# EAGLE design ESP-8266 Datalogger (EAGLE 7.5.0)
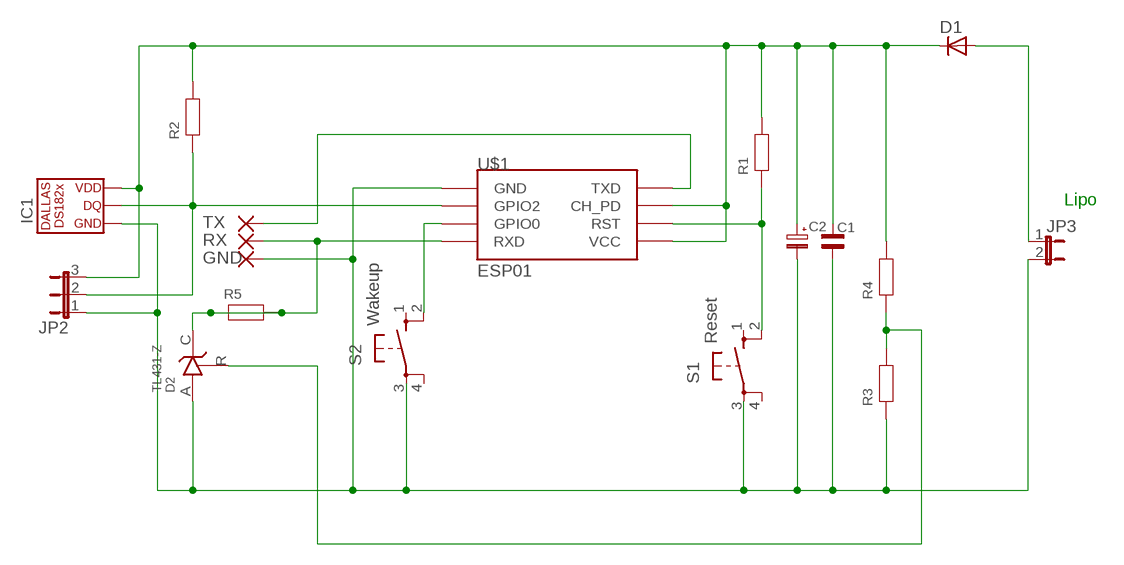
[diagram p0: schematic, sheet 1]

## Parts
C1  C-C1206  [C1206]
C2  ELKO-SMC_B  [SMC_B]
D1  BYS10  [SOD106A]
D2  TL431-Z  [TO92-Z]
GND  1,6/0,8  [1,6/0,8]
IC1  DS182X-L  [TO92-]
JP2  JP2E  [JP2]
JP3  JP1E  [JP1]
R1  R-R1206  [R1206]
R2  R-R1206  [R1206]
R3  R-R1206  [R1206]
R4  R-R1206  [R1206]
R5  R400MIL  [RES400]
RX  1,6/0,8  [1,6/0,8]
S1  Reset  10-XX  [B3F-10XX]
S2  Wakeup  10-XX  [B3F-10XX]
TX  1,6/0,8  [1,6/0,8]
U$1  ESP01  [ESP01]

## Nets
GND: C1.2 C2.- D2.A GND.1(P) IC1.C JP2.1 JP3.2 R3.1 S1.3 S2.3 U$1.GND
N$1: D1.A JP3.1
N$2: D2.R R3.2 R4.1
N$3: D2.C R5.1 R5.2 RX.1(P) U$1.RX(RXD)
N$4: TX.1(P) U$1.TX(TXD)
N$5: S2.2 U$1.GPIO0
N$6: R1.1 S1.2 U$1.RST
N$9: IC1.B JP2.2 R2.1 U$1.GPIO2
VCC: C1.1 C2.+ D1.K IC1.E JP2.3 R1.2 R2.2 R4.2 U$1.CH_PD U$1.VCC
Unconnected: S1.1 S1.4 S2.1 S2.4

## Notes on the sheet
- Lipo

## Library data of the parts
C1 = Basic:C: Kondensator: Grid - Baugröße; BEST-NR: xxxxxx-bp; LIEFERANT: Conrad
C2 = Basic:ELKO: Elektrolyt-Kondensator: Grid / Bauform / Durchmesser; BEST-NR: xxxxxx-bp; LIEFERANT: Conrad
D1 = Basic:BYS10: DIODE
D2 = Basic:TL431: Voltage Reference 2,45V
GND RX TX = wirepad:1,6/0,8: THROUGH-HOLE PAD
IC1 = Basic:DS182X; BEST-NR: 176494; LIEFERANT: Conrad
JP2 = jumper:JP2E: JUMPER
JP3 = jumper:JP1E: JUMPER
R1-R4 = Basic:R: Widerstand: Grid; BEST-NR: xxxxxx-bp; LIEFERANT: Conrad
R5 = Basic:R: Widerstand: Grid; BEST-NR: xxxxxx-bp; LIEFERANT: Conrad; PREIS: 0,02
S1 S2 = Basic:10-XX: OMRON SWITCH
U$1 = esp8266modules:ESP01: ESP8266 Wifi module 01

## Board
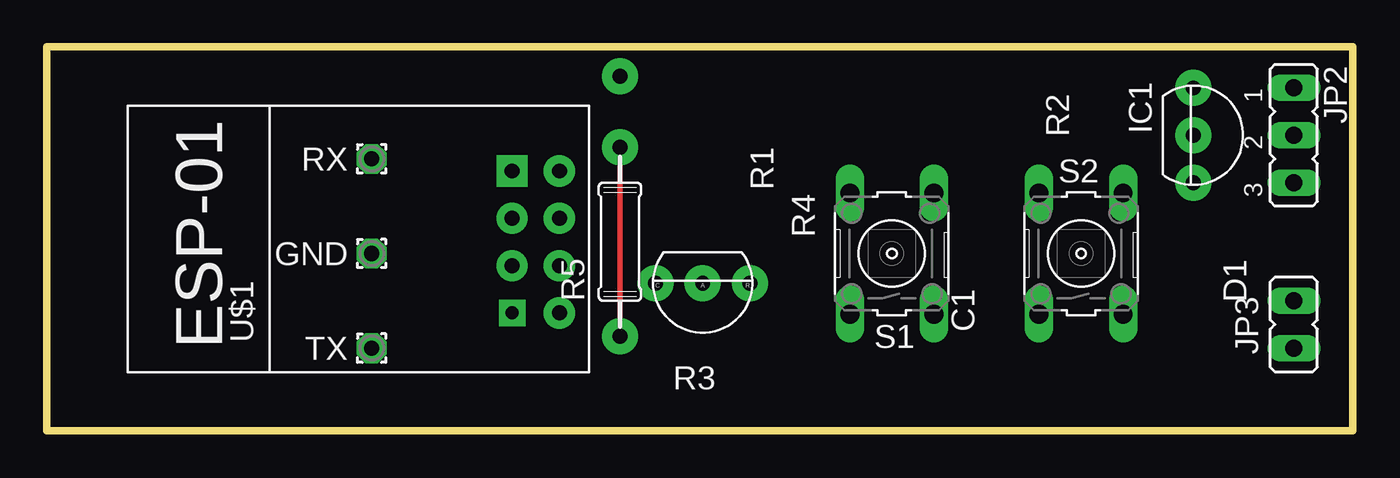
[diagram p1: board, top side]
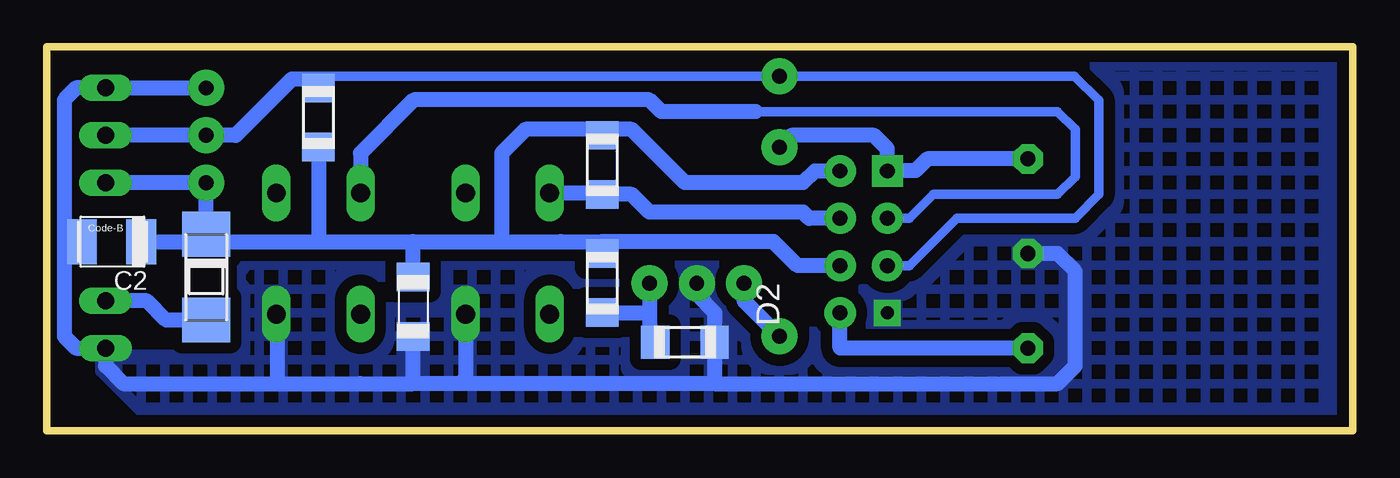
[diagram p2: board, bottom side, seen from below]

Size 70.17 x 20.64 mm. Coordinates in mm from the lower left corner, seen from the top.
Outline: 0,0 0,20.64 70.17,20.64 70.17,0 0,0
Copper layers (1*2*15*16): Top 0.035mm / dielectric 1.5mm / Route2 0.035mm / dielectric 0.15mm / Route15 0.035mm / dielectric 0.2mm / Bottom 0.035mm
Design rules "default_KB_13mil": minimum track width 18mil, minimum drill 24mil, track to track 13mil, track to pad 13mil, pad to pad 13mil, via to via 13mil, smd to smd 13mil, copper to edge 25mil, drill to drill 8mil, minimum pad ring 10mil, minimum via ring 8mil, stop-mask expansion 0mil, vias tented up to drill 0mil, thermal gap 10mil

### Footprints (pad centres in the part's own frame; a part is rotated, then mirrored left to right if it is on the bottom)
C1206 = smd 1.524 x 1.778: 1 -1.587,0; 2 1.587,0
SMC_B = smd 1.6 x 2.4: + -1.587,0; - 1.587,0
SOD106A = smd 2.4 x 2.6: A 2.3,0; K -2.3,0
TO92-Z = drill 0.8 pad 1.93: A 0,0; C 2.54,0; R -2.54,0
1,6/0,8 = drill 0.813 pad 1.6 octagon: 1 0,0
TO92- = drill 0.8 pad 1.93: B 0,0; C -2.54,0; E 2.54,0
JP2 = drill 0.914 long: 1 -2.54,0; 2 0,0; 3 2.54,0
JP1 = drill 0.914 long: 1 0,-1.27; 2 0,1.27
R1206 = smd 1.524 x 1.753: 1 -1.587,0; 2 1.587,0
RES400 = drill 0.8 pad 1.93: 1 -5.08,0; 2 5.08,0
B3F-10XX = drill 1.016 pad 1.524 long: 1 -3.251,2.261; 2 3.251,2.261; 3 -3.251,-2.261; 4 3.251,-2.261
ESP01 = drill 0.8 pad 1.676: CH_PD -1.285,-8.178; GPIO0 1.255,-5.638; GPIO2 -1.285,-5.638; RST 1.255,-8.178; TX -3.825,-8.178; VCC 3.795,-8.178 | drill 0.7 pad 1.422 square: GND -3.825,-5.638 | drill 0.8 pad 1.676 square: RX 3.795,-5.638

### Placement (x,y rotation side)
C1  50.48,6.67 270 bottom
C2  66.67,10.16 180 bottom
D1  61.59,8.26 270 bottom
D2  35.24,7.94 180 top
GND  17.46,9.53 0 top
IC1  61.59,15.88 270 top
JP2  66.99,15.88 270 top
JP3  66.99,5.71 180 top
R1  40.32,14.29 90 bottom
R2  55.56,16.83 270 bottom
R3  35.88,4.76 180 bottom
R4  40.32,7.94 90 bottom
R5  30.8,10.16 90 top
RX  17.46,14.61 0 top
S1  45.4,9.53 90 top
S2  55.56,9.53 90 top
TX  17.46,4.45 0 top
U$1  19.37,10.16 90 top

### Tracks (layer width: path | path; a pad name or v marks a point on that pad's centre or on a via)
GND
  Bottom 0.813: IC1.C JP2.1 68.58,18.41 69.22,17.78 69.22,10.16 | 34.29,2.54 47.94,2.54 | 47.94,2.54 50.48,2.54 | 50.48,2.54 C1.2 | S1.3 47.66,2.86 47.94,2.54 | 50.48,2.54 53.3,2.54 57.78,2.54 | 57.78,2.54 66.04,2.54 66.99,3.49 JP3.2 68.58,4.45 69.22,5.08 69.22,10.16 | 34.29,2.54 15.88,2.54 14.92,3.49 14.92,8.57 15.88,9.53 GND.1 | 34.29,2.54 R3.1 34.29,6.35 35.24,7.3 D2.A | S2.3 57.78,6.27 57.78,2.54 | C2.- 69.22,10.16
  pour Bottom (isolate 0.61, no thermals, hatched): 0,20.32 59.69,20.32 59.69,4.13 67.31,4.13 67.31,3.17 64.45,0.32 0,0.32
N$1
  Bottom 0.813: D1.A 63.74,5.96 64.77,6.99 JP3.1
N$2
  Bottom 0.813: 37.78,4.76 R3.2 37.78,4.76 | D2.R 37.78,6.35 | 37.78,6.35 37.78,4.76 | R4.1 37.78,6.35
N$3  (via drill 0.8 pad 1.93)
  Top 0.305: R5.2 R5.1
  Bottom 0.813: R5.2 30.16,15.88 25.72,15.88 25,15.16 U$1.RX 24.99,13.97 23.5,13.97 22.86,14.61 RX.1 | R5.1 32.7,6.99 D2.C
  other vias: 30.8,15.24 30.8,5.08
N$4
  Bottom 0.813: TX.1 27.54,4.45 U$1.TX
N$5
  Bottom 0.508: 32.07,17.14 15.88,17.14 14.92,16.19 14.92,13.65 15.88,12.7 22.54,12.7 23.83,11.41 U$1.GPIO0
  Bottom 0.813: 32.07,17.14 37.15,17.14 37.78,17.78 50.44,17.78 53.3,14.92 S2.2
N$6
  Bottom 0.813: R1.1 40.01,12.7 R1.1 | S1.2 40.01,12.78 R1.1 | U$1.RST 29.21,11.41 29.53,11.75 37.78,11.75 38.74,12.7 R1.1
N$7  (via drill 0.8 pad 1.93)
  other vias: 30.8,19.05
N$9
  Bottom 0.508: R2.1 55.56,18.89 | 55.72,18.89 55.72,19.05 55.4,19.05 51.75,19.05 30.8,19.05 14.95,19.05 13.65,17.75 13.65,12.7 14.92,11.43 21.27,11.43 23.83,8.88 U$1.GPIO2
  Bottom 0.813: JP2.2 IC1.B 60.01,15.88 56.99,18.89 55.72,18.89 55.56,18.89
VCC
  Bottom 0.813: 61.59,10.16 D1.K | D1.K IC1.E JP2.3 | 61.59,10.16 55.56,10.16 | 55.56,10.16 50.48,10.16 | 50.48,10.16 45.72,10.16 | 45.72,10.16 42.55,10.16 40.32,10.16 40.32,10.14 | C1.1 50.48,10.16 | 40.32,10.14 31.12,10.16 29.83,8.88 U$1.CH_PD | 40.32,10.14 R4.2 40.32,10.14 | 40.32,16.19 R1.2 40.32,16.19 | 40.32,16.19 44.45,16.19 45.72,14.92 45.72,10.16 | U$1.VCC 28.91,13.96 29.53,13.34 35.88,13.34 36.51,13.97 36.5,13.96 38.74,16.19 40.32,16.19 | R2.2 55.56,10.16 | C2.+ 61.59,10.16 | 61.59,10.16 D1.K